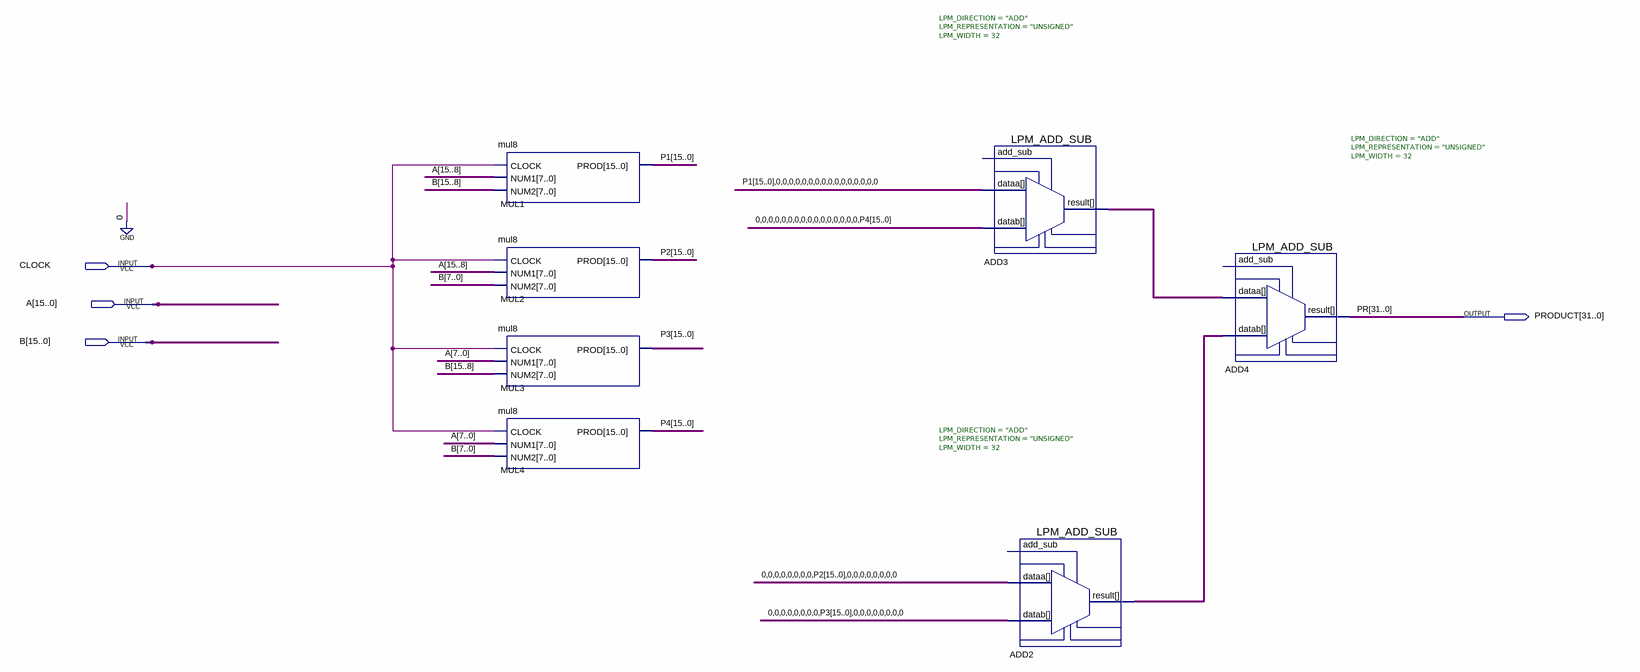
[diagram p0: schematic sheet]
// Quartus schematic mul16.bdf as structural Verilog: 7 symbols, 4 pins
module mul16 (
  input  CLOCK,
  input  [15:0] A,
  input  [15:0] B,
  output [31:0] PRODUCT
);

  wire [15:0] P1, P2, P3, P4;
  wire [31:0] ADD2_result, ADD3_result;

  mul8 MUL1 (.CLOCK(CLOCK), .NUM1(A[15:8]), .NUM2(B[15:8]), .PROD(P1));
  mul8 MUL2 (.CLOCK(CLOCK), .NUM1(A[15:8]), .NUM2(B[7:0]), .PROD(P2));
  mul8 MUL3 (.CLOCK(CLOCK), .NUM1(A[7:0]), .NUM2(B[15:8]), .PROD(P3));
  mul8 MUL4 (.CLOCK(CLOCK), .NUM1(A[7:0]), .NUM2(B[7:0]), .PROD(P4));
  LPM_ADD_SUB #(.LPM_DIRECTION("ADD"), .LPM_REPRESENTATION("UNSIGNED"), .LPM_WIDTH(32)) ADD3 (
    .datab({{16{1'b0}}, P4}), .dataa({P1, {16{1'b0}}}), .result(ADD3_result));  // open: add_sub
  LPM_ADD_SUB #(.LPM_DIRECTION("ADD"), .LPM_REPRESENTATION("UNSIGNED"), .LPM_WIDTH(32)) ADD2 (
    .datab({{8{1'b0}}, P3, {8{1'b0}}}), .dataa({{8{1'b0}}, P2, {8{1'b0}}}), .result(ADD2_result));  // open: add_sub
  LPM_ADD_SUB #(.LPM_DIRECTION("ADD"), .LPM_REPRESENTATION("UNSIGNED"), .LPM_WIDTH(32)) ADD4 (
    .datab(ADD2_result), .dataa(ADD3_result), .result(PRODUCT));  // open: add_sub

  // Other names for the same wires on the sheet: PR[31:0] = PRODUCT
endmodule
